# Altium project chicken.PrjPcb
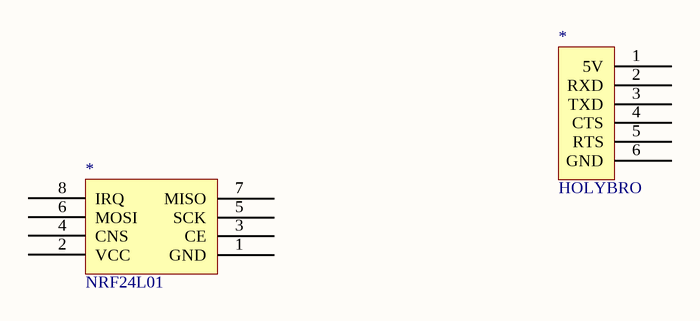
[diagram p0: chicken.SchDoc]
1 sheet, 2 parts. Net scope: global (net labels, ports and power ports of the same name join across sheets).
Board file: chicken.PcbDoc

## Sheet chicken.SchDoc
size A

### Parts
(Parts that share a designator on the sheet are numbered #1, #2 ... from top to bottom, then left to right.)
*#1  HOLYBRO  [HOLYBRO]
*#2  NRF24L01  [NRF24L01]

### Nets

Not connected (* = marked no-connect by the designer): *#1 1(5V) 2(RXD) 3(TXD) 4(CTS) 5(RTS) 6(GND); *#2 1(GND) 2(VCC) 3(CE) 4(CNS) 5(SCK) 6(MOSI) 7(MISO) 8(IRQ)